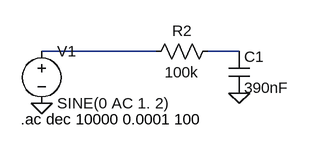
[diagram p0: schematic lowpass filter.asc]
lowpass filter.asc, the LTspice schematic file:
Version 4
SHEET 1 880 680
WIRE 48 -544 -128 -544
WIRE 176 -544 128 -544
FLAG 176 -480 0
FLAG -128 -464 0
SYMBOL res 144 -560 R90
WINDOW 0 0 56 VBottom 2
WINDOW 3 32 56 VTop 2
SYMATTR InstName R2
SYMATTR Value 100k
SYMBOL cap 160 -544 R0
SYMATTR InstName C1
SYMATTR Value 390nF
SYMBOL voltage -128 -560 R0
WINDOW 123 0 0 Left 0
WINDOW 39 0 0 Left 0
SYMATTR InstName V1
SYMATTR Value SINE(0 AC 1. 2)
TEXT -160 -440 Left 2 !.ac dec 10000 0.0001 100

The netlist it stands for:
* lowpass filter.asc
R2 N002 N001 100k
C1 N002 0 390nF
V1 N001 0 SINE(0 AC 1. 2)
.ac dec 10000 0.0001 100
.backanno
.end